# EAGLE design angrlline6 (EAGLE 9.6.2)
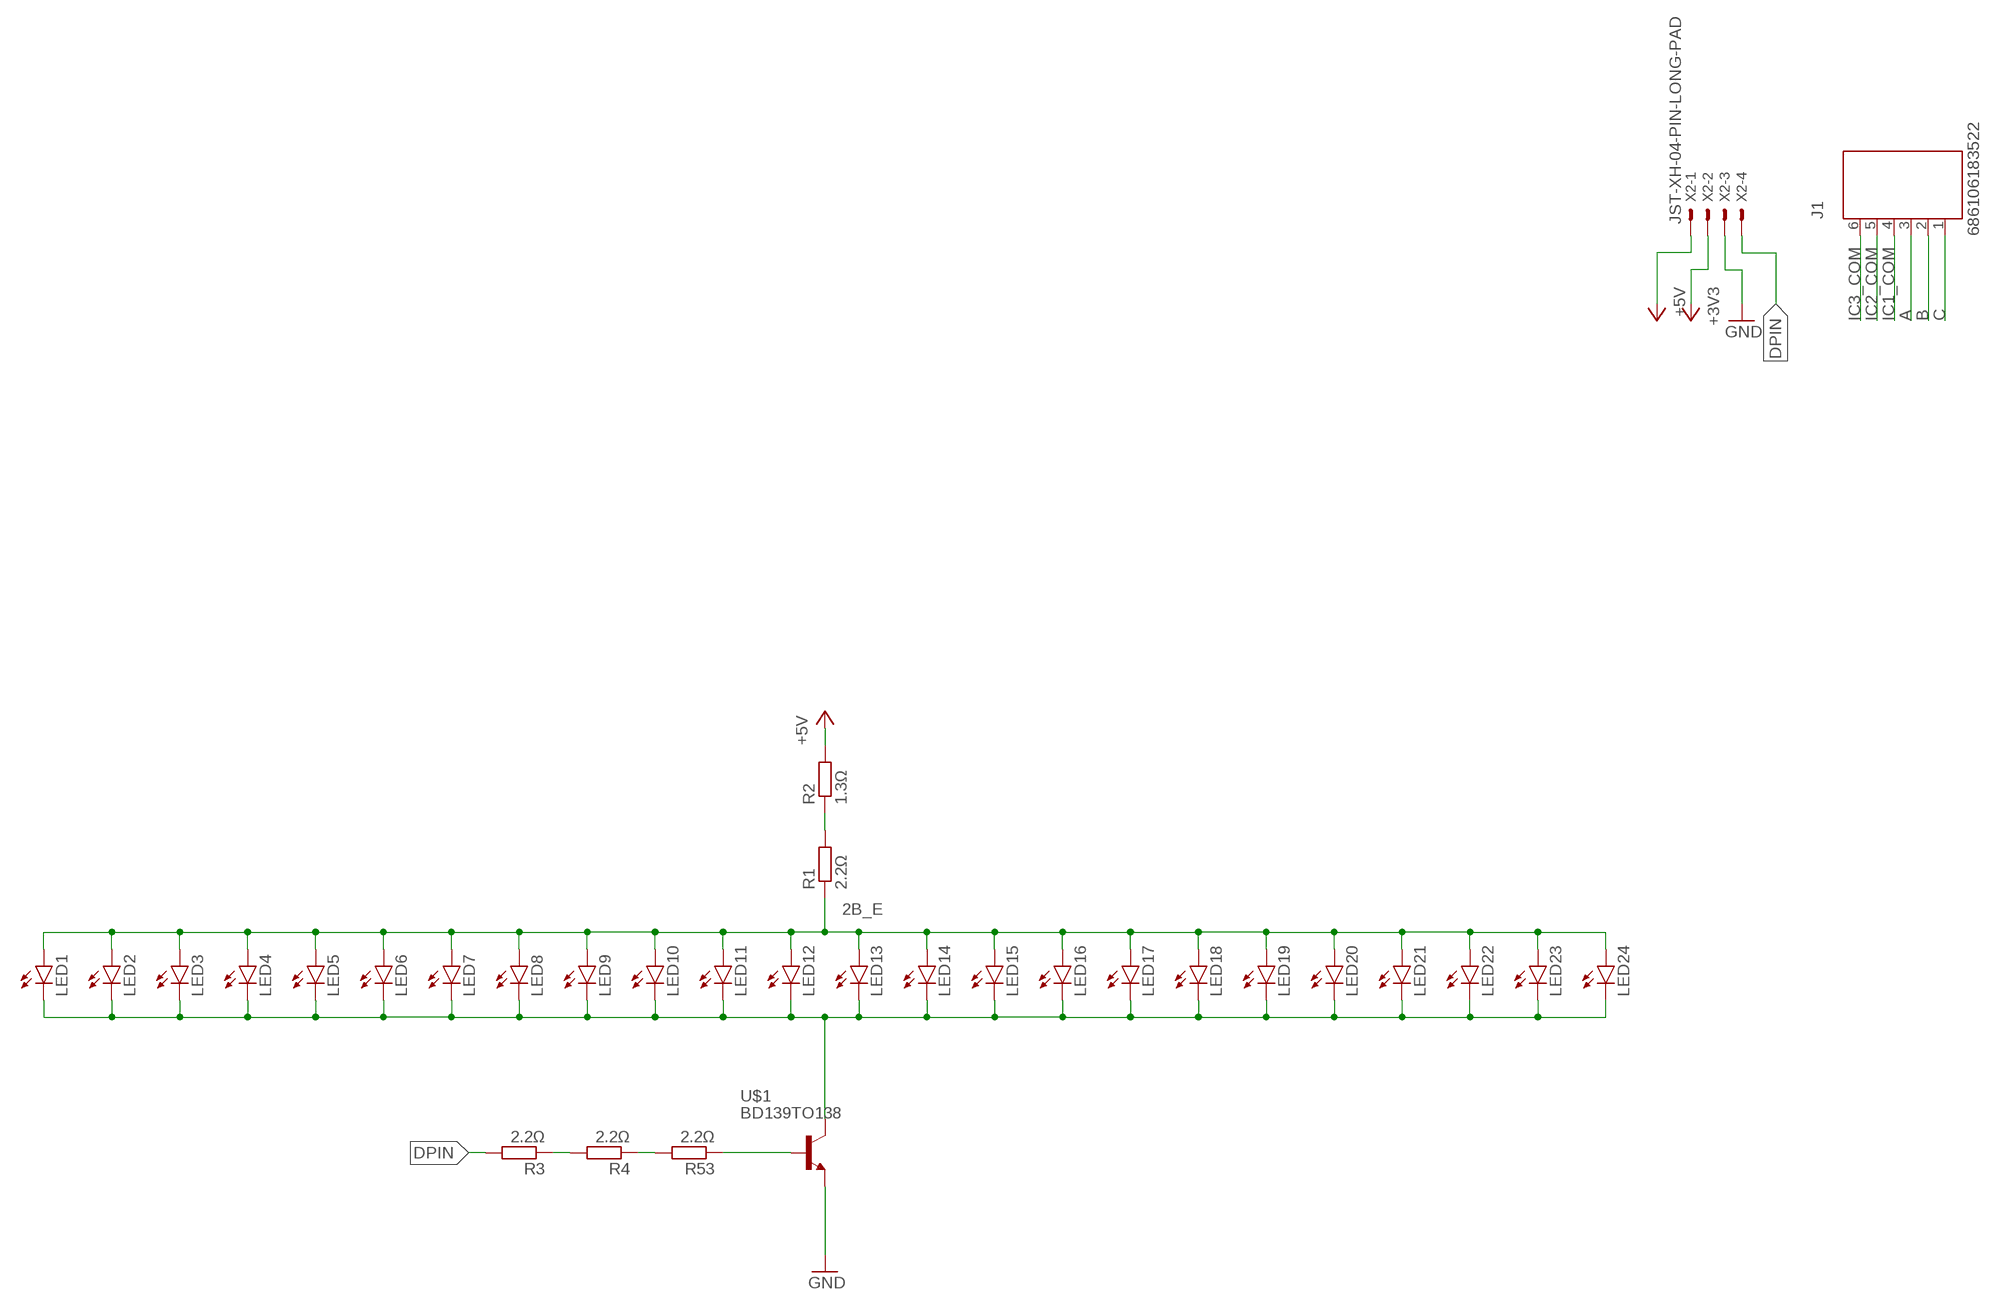
[diagram p0: schematic, sheet 1, part 1 of 2]
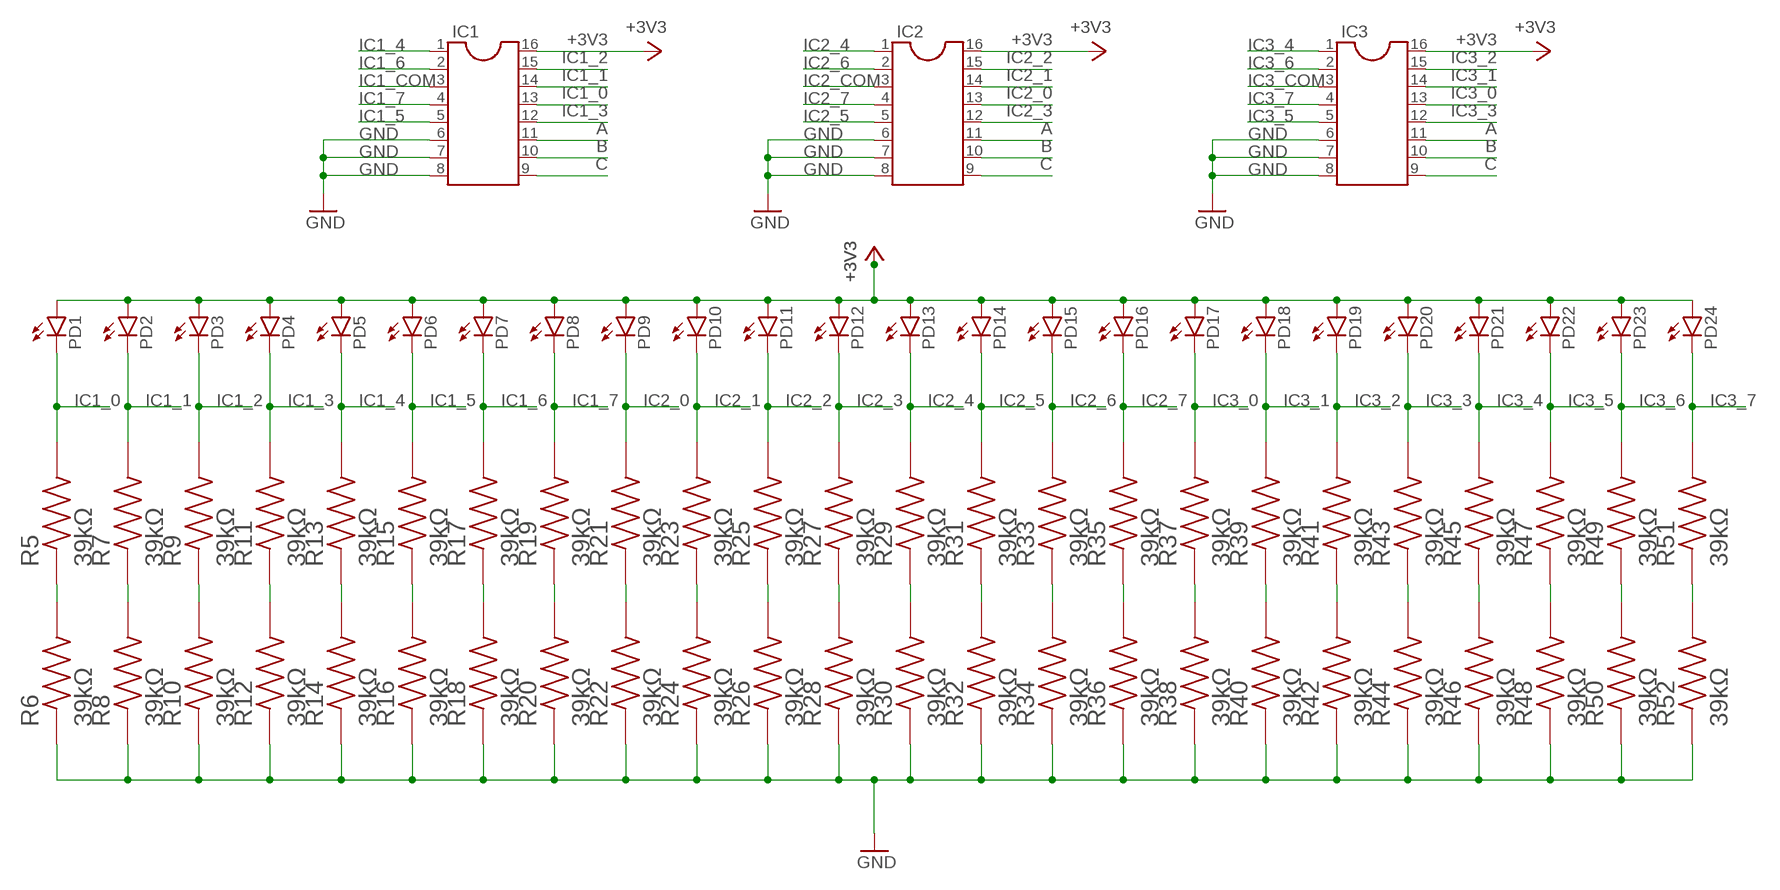
[diagram p1: schematic, sheet 1, part 2 of 2]

## Parts
IC1  DIL16  [DIL16]
IC2  DIL16  [DIL16]
IC3  DIL16  [DIL16]
J1  686106183522  [686106183522]
LED1  LED3MM  [LED3MM]
LED2  LED3MM  [LED3MM]
LED3  LED3MM  [LED3MM]
LED4  LED3MM  [LED3MM]
LED5  LED3MM  [LED3MM]
LED6  LED3MM  [LED3MM]
LED7  LED3MM  [LED3MM]
LED8  LED3MM  [LED3MM]
LED9  LED3MM  [LED3MM]
LED10  LED3MM  [LED3MM]
LED11  LED3MM  [LED3MM]
LED12  LED3MM  [LED3MM]
LED13  LED3MM  [LED3MM]
LED14  LED3MM  [LED3MM]
LED15  LED3MM  [LED3MM]
LED16  LED3MM  [LED3MM]
LED17  LED3MM  [LED3MM]
LED18  LED3MM  [LED3MM]
LED19  LED3MM  [LED3MM]
LED20  LED3MM  [LED3MM]
LED21  LED3MM  [LED3MM]
LED22  LED3MM  [LED3MM]
LED23  LED3MM  [LED3MM]
LED24  LED3MM  [LED3MM]
PD1  LED3MM  [LED3MM]
PD2  LED3MM  [LED3MM]
PD3  LED3MM  [LED3MM]
PD4  LED3MM  [LED3MM]
PD5  LED3MM  [LED3MM]
PD6  LED3MM  [LED3MM]
PD7  LED3MM  [LED3MM]
PD8  LED3MM  [LED3MM]
PD9  LED3MM  [LED3MM]
PD10  LED3MM  [LED3MM]
PD11  LED3MM  [LED3MM]
PD12  LED3MM  [LED3MM]
PD13  LED3MM  [LED3MM]
PD14  LED3MM  [LED3MM]
PD15  LED3MM  [LED3MM]
PD16  LED3MM  [LED3MM]
PD17  LED3MM  [LED3MM]
PD18  LED3MM  [LED3MM]
PD19  LED3MM  [LED3MM]
PD20  LED3MM  [LED3MM]
PD21  LED3MM  [LED3MM]
PD22  LED3MM  [LED3MM]
PD23  LED3MM  [LED3MM]
PD24  LED3MM  [LED3MM]
R1  2.2Ω  R-EU_0207/10  [0207/10]
R2  1.3Ω  R-EU_0207/10  [0207/10]
R3  2.2Ω  R-EU_0207/10  [0207/10]
R4  2.2Ω  R-EU_0207/10  [0207/10]
R5  39kΩ  CRG0603ZR  [RESC1608X55N]
R6  39kΩ  CRG0603ZR  [RESC1608X55N]
R7  39kΩ  CRG0603ZR  [RESC1608X55N]
R8  39kΩ  CRG0603ZR  [RESC1608X55N]
R9  39kΩ  CRG0603ZR  [RESC1608X55N]
R10  39kΩ  CRG0603ZR  [RESC1608X55N]
R11  39kΩ  CRG0603ZR  [RESC1608X55N]
R12  39kΩ  CRG0603ZR  [RESC1608X55N]
R13  39kΩ  CRG0603ZR  [RESC1608X55N]
R14  39kΩ  CRG0603ZR  [RESC1608X55N]
R15  39kΩ  CRG0603ZR  [RESC1608X55N]
R16  39kΩ  CRG0603ZR  [RESC1608X55N]
R17  39kΩ  CRG0603ZR  [RESC1608X55N]
R18  39kΩ  CRG0603ZR  [RESC1608X55N]
R19  39kΩ  CRG0603ZR  [RESC1608X55N]
R20  39kΩ  CRG0603ZR  [RESC1608X55N]
R21  39kΩ  CRG0603ZR  [RESC1608X55N]
R22  39kΩ  CRG0603ZR  [RESC1608X55N]
R23  39kΩ  CRG0603ZR  [RESC1608X55N]
R24  39kΩ  CRG0603ZR  [RESC1608X55N]
R25  39kΩ  CRG0603ZR  [RESC1608X55N]
R26  39kΩ  CRG0603ZR  [RESC1608X55N]
R27  39kΩ  CRG0603ZR  [RESC1608X55N]
R28  39kΩ  CRG0603ZR  [RESC1608X55N]
R29  39kΩ  CRG0603ZR  [RESC1608X55N]
R30  39kΩ  CRG0603ZR  [RESC1608X55N]
R31  39kΩ  CRG0603ZR  [RESC1608X55N]
R32  39kΩ  CRG0603ZR  [RESC1608X55N]
R33  39kΩ  CRG0603ZR  [RESC1608X55N]
R34  39kΩ  CRG0603ZR  [RESC1608X55N]
R35  39kΩ  CRG0603ZR  [RESC1608X55N]
R36  39kΩ  CRG0603ZR  [RESC1608X55N]
R37  39kΩ  CRG0603ZR  [RESC1608X55N]
R38  39kΩ  CRG0603ZR  [RESC1608X55N]
R39  39kΩ  CRG0603ZR  [RESC1608X55N]
R40  39kΩ  CRG0603ZR  [RESC1608X55N]
R41  39kΩ  CRG0603ZR  [RESC1608X55N]
R42  39kΩ  CRG0603ZR  [RESC1608X55N]
R43  39kΩ  CRG0603ZR  [RESC1608X55N]
R44  39kΩ  CRG0603ZR  [RESC1608X55N]
R45  39kΩ  CRG0603ZR  [RESC1608X55N]
R46  39kΩ  CRG0603ZR  [RESC1608X55N]
R47  39kΩ  CRG0603ZR  [RESC1608X55N]
R48  39kΩ  CRG0603ZR  [RESC1608X55N]
R49  39kΩ  CRG0603ZR  [RESC1608X55N]
R50  39kΩ  CRG0603ZR  [RESC1608X55N]
R51  39kΩ  CRG0603ZR  [RESC1608X55N]
R52  39kΩ  CRG0603ZR  [RESC1608X55N]
R53  2.2Ω  R-EU_0207/10  [0207/10]
U$1  BD139TO138  [TO126]
X2  JST-XH-04-PIN-LONG-PAD  [JST-XH-04-PACKAGE-LONG-PAD]

## Nets
2B_E: LED1.A LED2.A LED3.A LED4.A LED5.A LED6.A LED7.A LED8.A LED9.A LED10.A LED11.A LED12.A LED13.A LED14.A LED15.A LED16.A LED17.A LED18.A LED19.A LED20.A LED21.A LED22.A LED23.A LED24.A R1.1
+3V3: IC1.16 IC2.16 IC3.16 PD1.A PD2.A PD3.A PD4.A PD5.A PD6.A PD7.A PD8.A PD9.A PD10.A PD11.A PD12.A PD13.A PD14.A PD15.A PD16.A PD17.A PD18.A PD19.A PD20.A PD21.A PD22.A PD23.A PD24.A X2.2
+5V: R2.2 X2.1
A: IC1.11 IC2.11 IC3.11 J1.3
B: IC1.10 IC2.10 IC3.10 J1.2
BASE: R53.1 U$1.B
C: IC1.9 IC2.9 IC3.9 J1.1
DPIN: R3.2 X2.4
ENCODE: LED1.K(C) LED2.K(C) LED3.K(C) LED4.K(C) LED5.K(C) LED6.K(C) LED7.K(C) LED8.K(C) LED9.K(C) LED10.K(C) LED11.K(C) LED12.K(C) LED13.K(C) LED14.K(C) LED15.K(C) LED16.K(C) LED17.K(C) LED18.K(C) LED19.K(C) LED20.K(C) LED21.K(C) LED22.K(C) LED23.K(C) LED24.K(C) U$1.C
GND: IC1.6 IC1.7 IC1.8 IC2.6 IC2.7 IC2.8 IC3.6 IC3.7 IC3.8 R6.1 R8.1 R10.1 R12.1 R14.1 R16.1 R18.1 R20.1 R22.1 R24.1 R26.1 R28.1 R30.1 R32.1 R34.1 R36.1 R38.1 R40.1 R42.1 R44.1 R46.1 R48.1 R50.1 R52.1 U$1.E X2.3
IC1_0: IC1.13 PD1.K(C) R5.2
IC1_1: IC1.14 PD2.K(C) R7.2
IC1_2: IC1.15 PD3.K(C) R9.2
IC1_3: IC1.12 PD4.K(C) R11.2
IC1_4: IC1.1 PD5.K(C) R13.2
IC1_5: IC1.5 PD6.K(C) R15.2
IC1_6: IC1.2 PD7.K(C) R17.2
IC1_7: IC1.4 PD8.K(C) R19.2
IC1_COM: IC1.3 J1.4
IC2_0: IC2.13 PD9.K(C) R21.2
IC2_1: IC2.14 PD10.K(C) R23.2
IC2_2: IC2.15 PD11.K(C) R25.2
IC2_3: IC2.12 PD12.K(C) R27.2
IC2_4: IC2.1 PD13.K(C) R29.2
IC2_5: IC2.5 PD14.K(C) R31.2
IC2_6: IC2.2 PD15.K(C) R33.2
IC2_7: IC2.4 PD16.K(C) R35.2
IC2_COM: IC2.3 J1.5
IC3_0: IC3.13 PD17.K(C) R37.2
IC3_1: IC3.14 PD18.K(C) R39.2
IC3_2: IC3.15 PD19.K(C) R41.2
IC3_3: IC3.12 PD20.K(C) R43.2
IC3_4: IC3.1 PD21.K(C) R45.2
IC3_5: IC3.5 PD22.K(C) R47.2
IC3_6: IC3.2 PD23.K(C) R49.2
IC3_7: IC3.4 PD24.K(C) R51.2
IC3_COM: IC3.3 J1.6
N$1: R1.2 R2.1
N$4: R7.1 R8.2
N$6: R9.1 R10.2
N$8: R11.1 R12.2
N$10: R13.1 R14.2
N$12: R15.1 R16.2
N$14: R17.1 R18.2
N$16: R19.1 R20.2
N$18: R21.1 R22.2
N$20: R23.1 R24.2
N$22: R25.1 R26.2
N$24: R27.1 R28.2
N$26: R29.1 R30.2
N$27: R5.1 R6.2
N$28: R4.1 R53.2
N$30: R3.1 R4.2
N$31: R31.1 R32.2
N$33: R33.1 R34.2
N$35: R35.1 R36.2
N$37: R37.1 R38.2
N$39: R39.1 R40.2
N$41: R41.1 R42.2
N$43: R43.1 R44.2
N$45: R45.1 R46.2
N$47: R47.1 R48.2
N$49: R49.1 R50.2
N$51: R51.1 R52.2
Unconnected: U$1.C2

## Library data of the parts
IC1-IC3 = ic-package:DIL16: Dual In Line / Socket
J1 = 686106183522:686106183522: 686106183522 WR-FPC 1.00mm SMT Horizontal Bottom Contact - Low Profile <http://katalog.we-online.de/media/images/v2/Family_WR-FPC_6861xx183522.jpg> Details see: http://katalog.we-online.de/en/em/FPC_1_00_SMT_ZIF_HORIZONTAL_BOTTOM_CONTACT_LOW_PROFILE_6861xx183522 Created by Yingchun,shan 2016 (C) Wurth Elektronik Check availability <https://pricing.snapeda.com/parts/686106183522/Wurth%20Electronics/view-part?ref=eda>; AVAILABILITY: In Stock; DESCRIPTION: 6 Position FFC Connector Contacts, Bottom 0.039 (1.00mm) Surface Mount, Right Angle; MF: Wurth Electronics; MP: 686106183522; PACKAGE: None; PRICE: None; PURCHASE-URL: https://pricing.snapeda.com/search/part/686106183522/?ref=eda
LED1-LED24 PD1-PD24 = led:LED: LED OSRAM: - CHIPLED LG R971, LG N971, LY N971, LG Q971, LY Q971, LO R971, LY R971 LH N974, LH R974 LS Q976, LO Q976, LY Q976 LO Q996 - Hyper CHIPLED LW Q18S LB Q993, LB Q99A, LB R99A - SideLED LS A670, LO A670, LY A670, LG A670, LP A670 LB A673, LV A673, LT A673, LW A673 LH A674 LY A675 LS A676, LA A676, LO A676, LY A676, LW A676 LS A679, LY A679, LG A679 - Hyper Micro SIDELED® LS Y876, LA Y876, LO Y876, LY Y876 LT Y87S - SmartLED LW L88C, LW L88S LB L89C, LB L89S, LG L890 LS L89K, LO L89K, LY L89K LS L896, LA L896, LO L896, LY L896 - TOPLED LS T670, LO T670, LY T670, LG T670, LP T670 LSG T670, LSP T670, LSY T670, LOP T670, LYG T670 LG T671, LOG T671, LSG T671 LB T673, LV T673, LT T673, LW T673 LH T674 LS T676, LA T676, LO T676, LY T676, LB T676, LH T676, LSB T676, LW T676 LB T67C, LV T67C, LT T67C, LS T67K, LO T67K, LY T67K, LW E67C LS E67B, LA E67B, LO E67B, LY E67B, LB E67C, LV E67C, LT E67C LW T67C LS T679, LY T679, LG T679 LS T770, LO T770, LY T770, LG T770, LP T770 LB T773, LV T773, LT T773, LW T773 LH T774 LS E675, LA E675, LY E675, LS T675 LS T776, LA T776, LO T776, LY T776, LB T776 LHGB T686 LT T68C, LB T68C - Hyper Mini TOPLED® LB M676 - Mini TOPLED Santana® LG M470 LS M47K, LO M47K, LY M47K Source: http://www.osram.convergy.de LUXEON: - LUMILED® LXK2-PW12-R00, LXK2-PW12-S00, LXK2-PW14-U00, LXK2-PW14-V00 LXK2-PM12-R00, LXK2-PM12-S00, LXK2-PM14-U00 LXK2-PE12-Q00, LXK2-PE12-R00, LXK2-PE12-S00, LXK2-PE14-T00, LXK2-PE14-U00 LXK2-PB12-K00, LXK2-PB12-L00, LXK2-PB12-M00, LXK2-PB14-N00, LXK2-PB14-P00, LXK2-PB14-Q00 LXK2-PR12-L00, LXK2-PR12-M00, LXK2-PR14-Q00, LXK2-PR14-R00 LXK2-PD12-Q00, LXK2-PD12-R00, LXK2-PD12-S00 LXK2-PH12-R00, LXK2-PH12-S00 LXK2-PL12-P00, LXK2-PL12-Q00, LXK2-PL12-R00 Source: www.luxeon.com KINGBRIGHT: KA-3528ASYC Source: www.kingbright.com
R1-R4 R53 = rcl:R-EU_: RESISTOR, European symbol; SPICEPREFIX: R
R5-R52 = CRG0603ZR:CRG0603ZR: CRG0603 ZEROHM Check availability <https://pricing.snapeda.com/parts/CRG0603ZR/TE%20Connectivity/view-part?ref=eda>; AVAILABILITY: In Stock; COMMENT: 1623094-1; DESCRIPTION: CRG0603 ZEROHM; EU_ROHS_COMPLIANCE: Compliant with Exemptions; MF: TE Connectivity; MP: CRG0603ZR; PACKAGE: 0603; PRICE: None; PURCHASE-URL: https://pricing.snapeda.com/search/part/CRG0603ZR/?ref=eda
U$1 = BD139:BD139: Check availability <https://pricing.snapeda.com/parts/BD139/ON/view-part?ref=eda>; AVAILABILITY: In Stock; DESCRIPTION: Bipolar (BJT) Transistor NPN 80 V 1.5 A - 1.25 W Through Hole TO-126-3; MF: ON; MP: BD139; PACKAGE: TO-126 STMicroelectronics; PRICE: None; PURCHASE-URL: https://pricing.snapeda.com/search/part/BD139/?ref=eda
X2 = Rembrandt Electronics - JST XH Connectors v1-0:JST-XH-04-PIN: JST XH Connector 2 Pin Wire to board connector. Pitch: 2,54 mm, (0.100") Number of pins: 4 Created by Rembrandt Electronics www.rembrandtelectronics.com

## Net classes
0 default: width 0.5 mm, clearance 0.3 mm

## Board
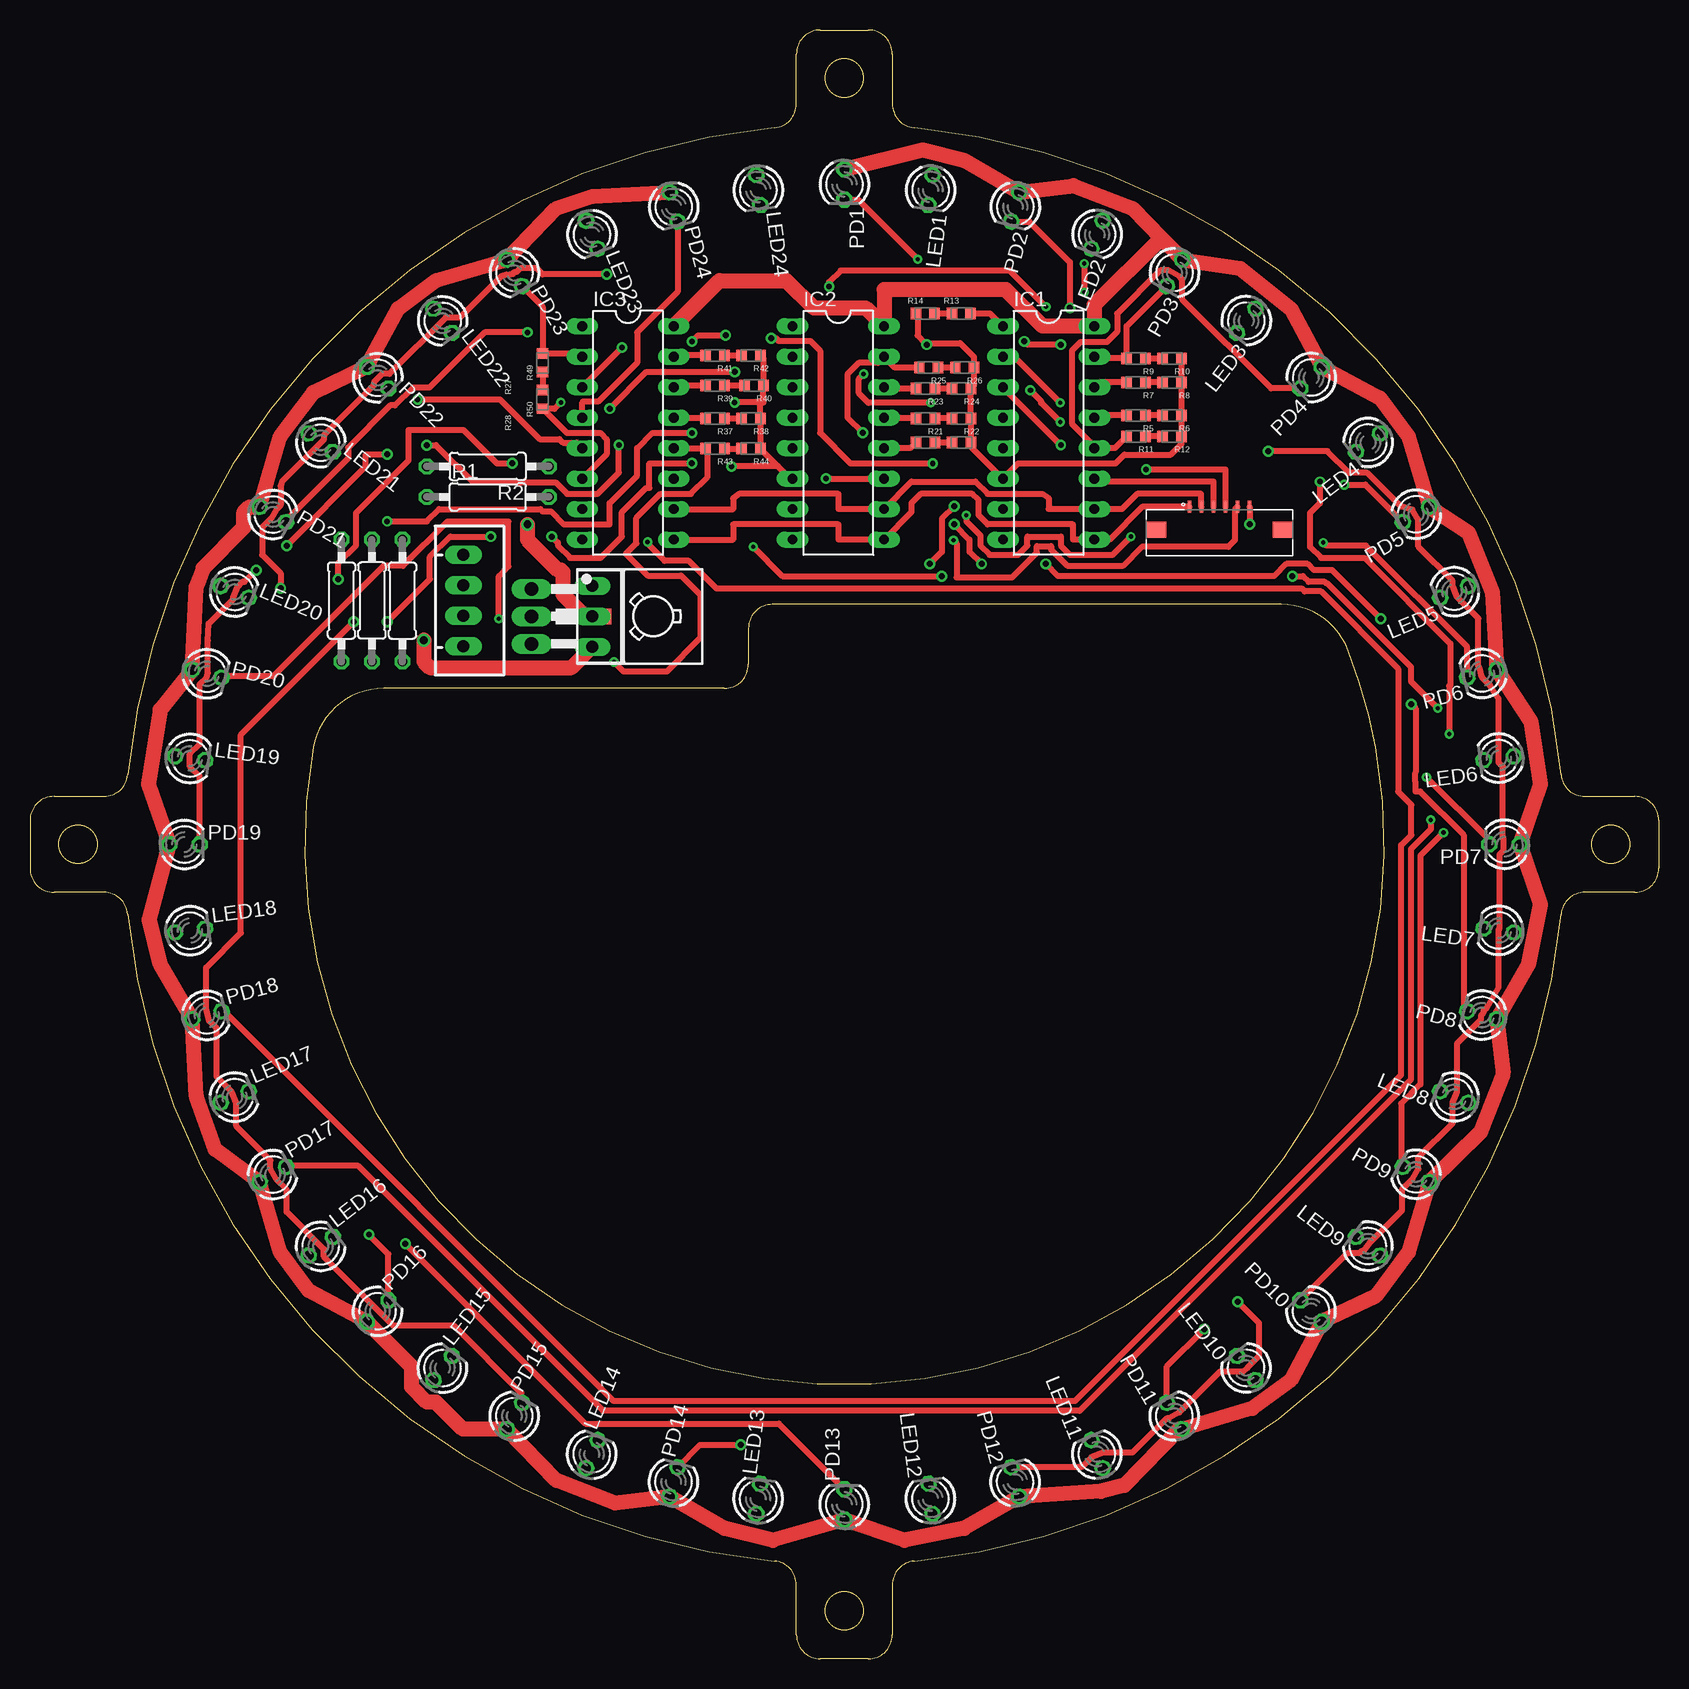
[diagram p2: board, top side]
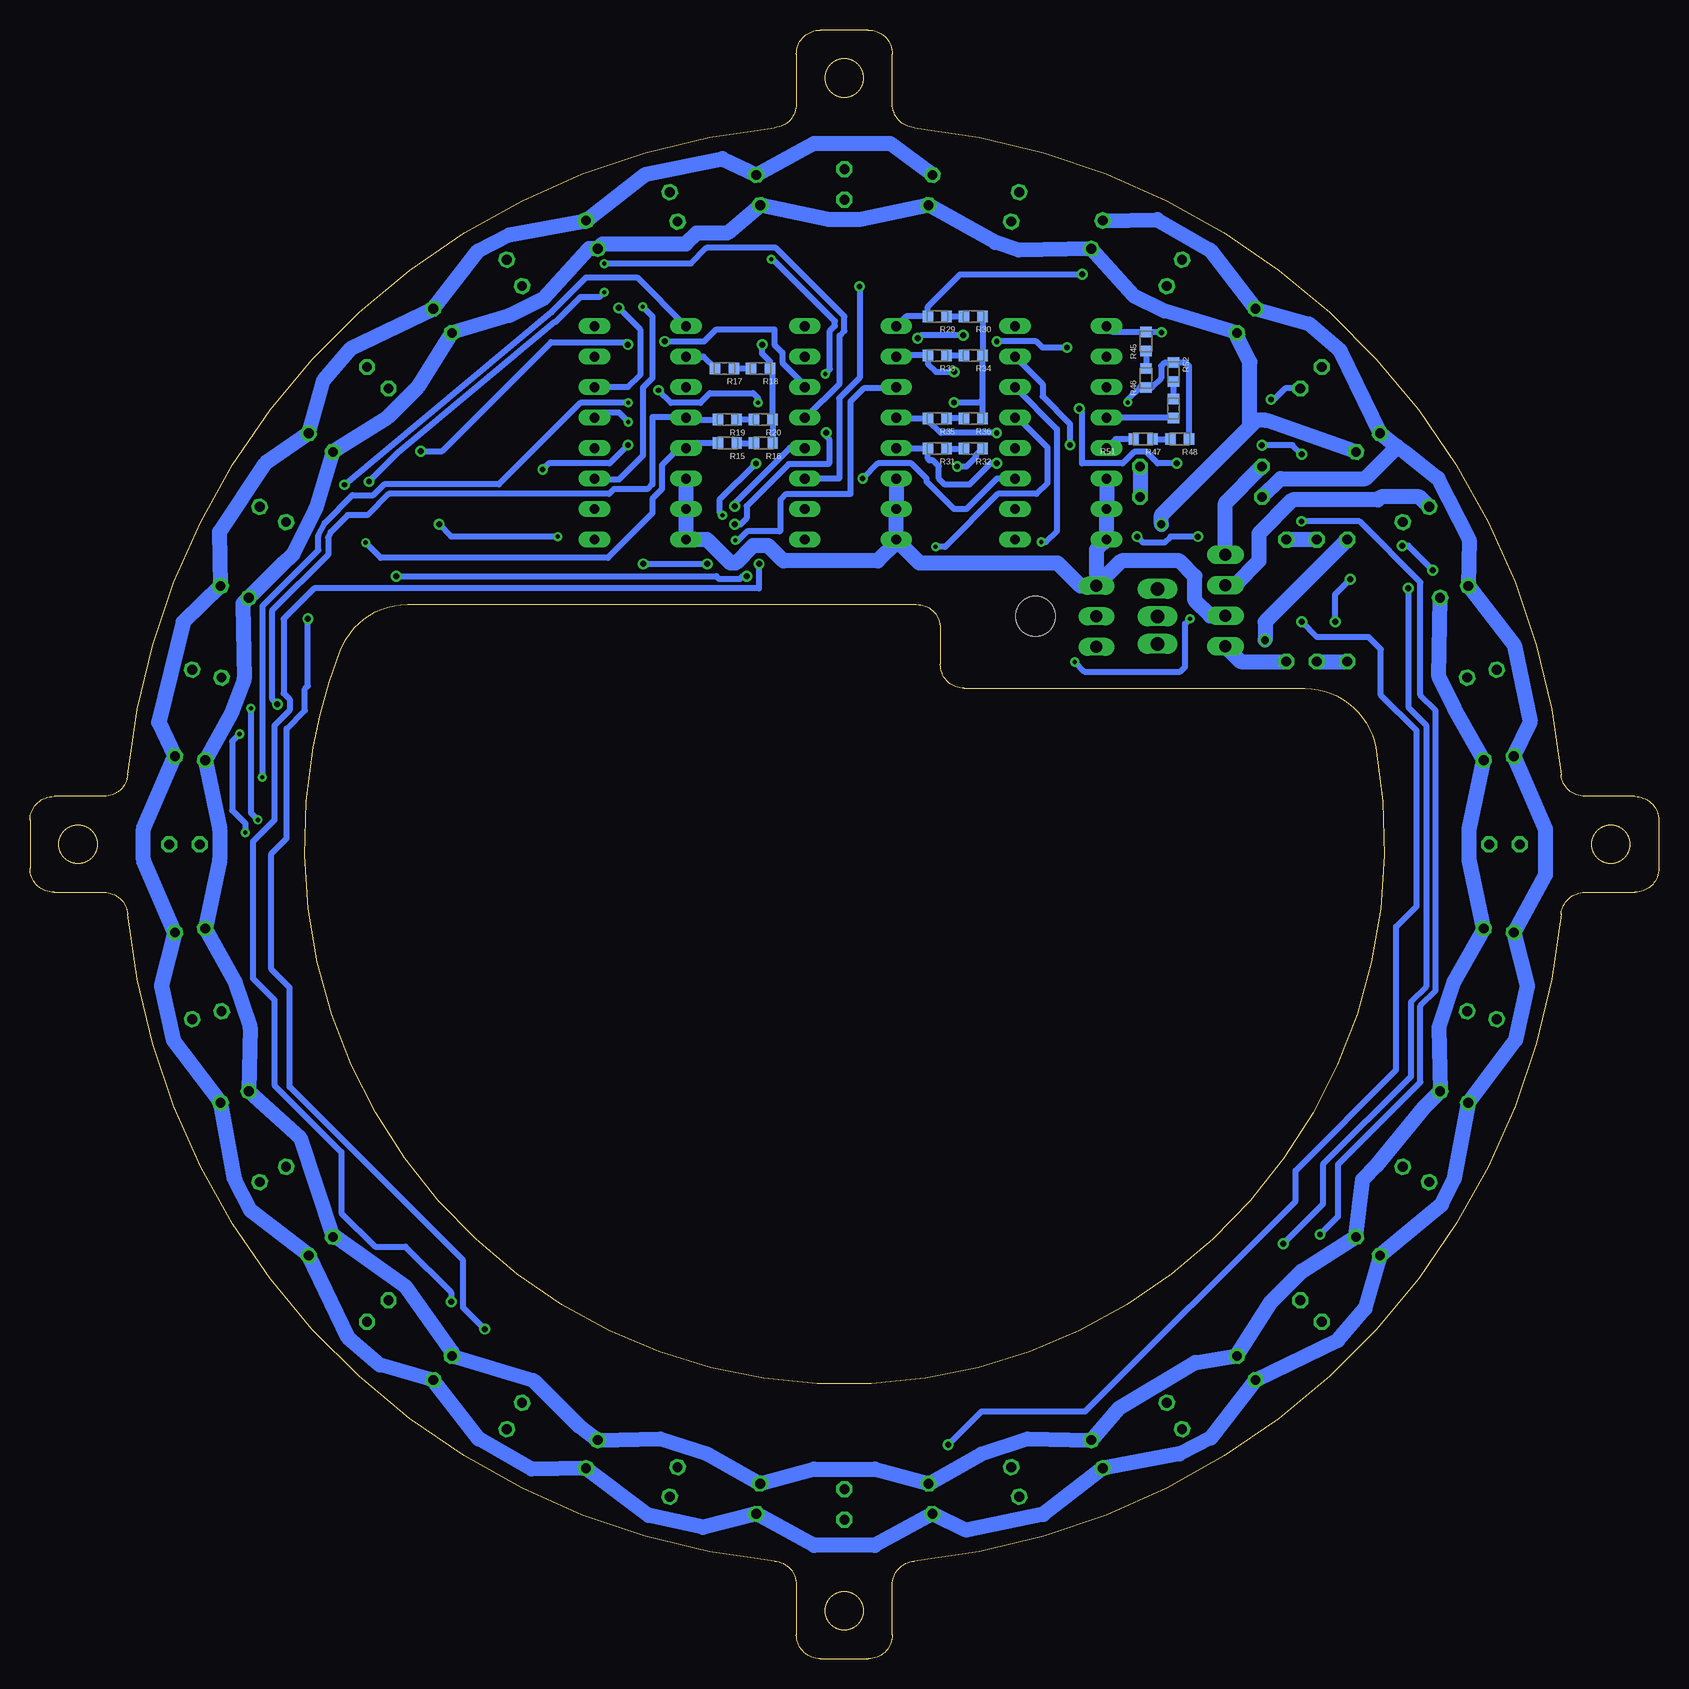
[diagram p3: board, bottom side, seen from below]

Size 135.73 x 135.73 mm. Coordinates in mm from the lower left corner, seen from the top.
Outline: 29.5,80.87 arc80 23.6,75.94
Outline: 23.6,75.94 arc201 112.14,75.94
Outline: 112.14,75.94 arc11 109.87,84.02
Outline: 23.6,75.94 arc201 112.14,75.94
Outline: 109.87,84.02 arc69 104.27,87.87
Outline: 61.87,87.87 arc90 59.87,85.87
Outline: 57.87,80.87 arc90 59.87,82.87
Outline: 57.87,80.87 arc90 59.87,82.87
Outline: 61.87,87.87 arc90 59.87,85.87
Outline: 109.87,84.02 arc69 104.27,87.87
Outline: 23.6,75.94 arc201 112.14,75.94
Outline: 112.14,75.94 arc11 109.87,84.02
Outline: 29.5,80.87 arc80 23.6,75.94
Outline: 57.87,80.87 29.5,80.87
Outline: 104.27,87.87 61.87,87.87
Outline: 59.87,85.87 59.87,82.87
Outline: 63.87,6.16 arc84 62.06,8.15 arc-79 8.15,62.06 arc84 6.16,63.87 2,63.87 arc-90 0,65.87 0,69.87 arc-90 2,71.87 6.16,71.87 arc84 8.15,73.67 arc-79 62.06,127.58 arc84 63.87,129.58 63.87,133.73 arc-90 65.87,135.73 69.87,135.73 arc-90 71.87,133.73 71.87,129.58 arc84 73.67,127.58 arc-79 127.58,73.67 arc84 129.58,71.87 133.73,71.87 arc-90 135.73,69.87 135.73,65.87 arc-90 133.73,63.87 129.58,63.87 arc84 127.58,62.06 arc-79 73.67,8.15 arc84 71.87,6.16 71.87,2 arc-90 69.87,0 65.87,0 arc-90 63.87,2 63.87,6.16
Outline: circle at 67.87,131.73 radius 1.6
Outline: circle at 4,67.87 radius 1.6
Outline: circle at 67.87,4 radius 1.6
Outline: circle at 131.73,67.87 radius 1.6
Outline: circle at 4,67.87 radius 1.6
Outline: circle at 131.73,67.87 radius 1.6
Outline: circle at 67.87,4 radius 1.6
Outline: circle at 67.87,4 radius 1.6
Outline: circle at 131.73,67.87 radius 1.6
Outline: circle at 4,67.87 radius 1.6
Outline: circle at 67.87,131.73 radius 1.6
Outline: circle at 67.87,131.73 radius 1.6
Outline: circle at 67.87,131.73 radius 1.6
Outline: circle at 4,67.87 radius 1.6
Outline: circle at 67.87,4 radius 1.6
Outline: circle at 131.73,67.87 radius 1.6
Outline: circle at 67.87,131.73 radius 1.6
Outline: circle at 131.73,67.87 radius 1.6
Outline: circle at 67.87,4 radius 1.6
Outline: circle at 4,67.87 radius 1.6
Copper layers (1*16): Top 0.035mm / dielectric 1.5mm / Bottom 0.035mm
Design rules "default": minimum track width 6mil, minimum drill 0.35mm, track to track 6mil, track to pad 6mil, pad to pad 6mil, via to via 6mil, smd to smd 6mil, copper to edge 40mil, drill to drill 6mil, minimum pad ring 10mil, minimum via ring 8mil, stop-mask expansion 4mil, vias tented up to drill 0mil, thermal gap 10mil

### Footprints (pad centres in the part's own frame; a part is rotated, then mirrored left to right if it is on the bottom)
DIL16 = drill 0.813 long: 1 -8.89,-3.81; 2 -6.35,-3.81; 3 -3.81,-3.81; 4 -1.27,-3.81; 5 1.27,-3.81; 6 3.81,-3.81; 7 6.35,-3.81; 8 8.89,-3.81; 9 8.89,3.81; 10 6.35,3.81; 11 3.81,3.81; 12 1.27,3.81; 13 -1.27,3.81; 14 -3.81,3.81; 15 -6.35,3.81; 16 -8.89,3.81
686106183522 = smd 0.3 x 1: 1 -2.5,1.9; 2 -1.5,1.9; 3 -0.5,1.9; 4 0.5,1.9; 5 1.5,1.9; 6 2.5,1.9 | smd 1.65 x 1.3: Z1 -5.275,0; Z2 5.275,0
LED3MM = drill 0.813 octagon: A -1.27,0; K 1.27,0
0207/10 = drill 0.813 octagon: 1 -5.08,0; 2 5.08,0
RESC1608X55N = smd 0.87 x 0.97: 1 -0.78,0; 2 0.78,0
TO126 = drill 1.118 long: 1 -2.286,-5.08; 2 0,-5.08; 3 2.286,-5.08 | drill 1 long: B 2.54,0; C 0,0; E -2.54,0 | smd 1.27 x 0.635: C2 0,1.27 | hole 3.302: 0,5.08
JST-XH-04-PACKAGE-LONG-PAD = drill 1.016 long: 1 -3.81,0; 2 -1.27,0; 3 1.27,0; 4 3.81,0

### Placement (x,y rotation side)
IC1  84.88,102.16 270 top
IC2  67.36,102.16 270 top
IC3  49.83,102.16 270 top
J1  99.12,94.09 0 top
LED1  75.05,122.4 262.5 top
LED2  88.91,118.68 247.5 top
LED3  101.35,111.5 232.5 top
LED4  111.5,101.35 217.5 top
LED5  118.68,88.91 202.5 top
LED6  122.4,75.05 187.5 top
LED7  122.4,60.69 172.5 top
LED8  118.68,46.82 157.5 top
LED9  111.5,34.38 142.5 top
LED10  101.35,24.23 127.5 top
LED11  88.91,17.05 112.5 top
LED12  75.05,13.34 97.5 top
LED13  60.69,13.34 82.5 top
LED14  46.82,17.05 67.5 top
LED15  34.38,24.23 52.5 top
LED16  24.23,34.38 37.5 top
LED17  17.05,46.82 22.5 top
LED18  13.34,60.69 7.5 top
LED19  13.34,75.05 352.5 top
LED20  17.05,88.91 337.5 top
LED21  24.23,101.35 322.5 top
LED22  34.38,111.5 307.5 top
LED23  46.82,118.68 292.5 top
LED24  60.69,122.4 277.5 top
PD1  67.87,122.87 270 top
PD2  82.1,120.99 255 top
PD3  95.37,115.5 240 top
PD4  106.76,106.76 225 top
PD5  115.5,95.37 210 top
PD6  120.99,82.1 195 top
PD7  122.87,67.87 180 top
PD8  120.99,53.63 165 top
PD9  115.5,40.37 150 top
PD10  106.76,28.98 135 top
PD11  95.37,20.24 120 top
PD12  82.1,14.74 105 top
PD13  67.87,12.87 90 top
PD14  53.63,14.74 75 top
PD15  40.37,20.24 60 top
PD16  28.98,28.98 45 top
PD17  20.24,40.37 30 top
PD18  14.74,53.63 15 top
PD19  12.87,67.87 0 top
PD20  14.74,82.1 345 top
PD21  20.24,95.37 330 top
PD22  28.98,106.76 315 top
PD23  40.37,115.5 300 top
PD24  53.63,120.99 285 top
R1  38.15,96.82 0 top
R2  38.15,99.36 180 top
R3  31.04,88.19 270 top
R4  28.5,88.19 90 top
R5  92.17,103.61 180 top
R6  95.17,103.61 180 top
R7  92.17,106.36 180 top
R8  95.17,106.36 180 top
R9  92.17,108.36 180 top
R10  95.17,108.36 180 top
R11  92.17,101.87 180 top
R12  95.17,101.87 180 top
R13  77.61,112.11 0 top
R14  74.61,112.11 0 top
R15  77.62,101.3 180 bottom
R16  74.62,101.3 180 bottom
R17  77.86,107.53 180 bottom
R18  74.86,107.53 180 bottom
R19  77.62,103.26 180 bottom
R20  74.62,103.26 180 bottom
R21  74.63,103.36 180 top
R22  77.63,103.36 180 top
R23  74.63,105.85 180 top
R24  77.63,105.85 180 top
R25  74.88,107.6 180 top
R26  77.88,107.6 180 top
R27  74.63,101.36 180 top
R28  77.63,101.36 180 top
R29  60.12,111.87 180 bottom
R30  57.12,111.87 180 bottom
R31  60.12,100.85 180 bottom
R32  57.12,100.85 180 bottom
R33  60.12,108.61 180 bottom
R34  57.12,108.61 180 bottom
R35  60.12,103.36 180 bottom
R36  57.12,103.36 180 bottom
R37  57.08,103.36 180 top
R38  60.08,103.36 180 top
R39  57.08,106.1 180 top
R40  60.34,106.1 180 top
R41  57.08,108.61 180 top
R42  60.08,108.61 180 top
R43  57.08,100.85 180 top
R44  60.08,100.85 180 top
R45  42.72,109.78 90 bottom
R46  42.72,106.73 90 bottom
R47  42.97,101.65 180 bottom
R48  39.93,101.65 180 bottom
R49  42.72,108 90 top
R50  42.72,104.95 90 top
R51  40.43,104.19 270 bottom
R52  40.43,107.24 270 bottom
R53  25.96,88.19 270 top
U$1  46.87,86.87 270 top
X2  36.12,88.19 270 top

### Tracks (layer width: path | path; a pad name or v marks a point on that pad's centre or on a via)
2B_E
  Bottom 1.27: LED23.A 41.8,119.93 37.39,117.4 LED22.A 29.15,111.23 26.53,109 LED21.A 21.79,101.02 | 21.79,101.02 21.11,100.49 18.4,98.4 15.8,93.27 LED20.A 12.04,84.44 10.72,78.03 LED19.A 9.45,69.14 9.45,65.33 LED18.A 10.95,56.09 11.95,51.54 LED17.A 17.07,39.93 18.11,37.83 LED16.A 24.5,29.15 26.73,26.53 LED15.A 37.34,18.4 39.93,17.07 LED14.A 51.29,12.04 57.71,10.72 LED13.A 65.33,9.45 70.41,9.45 LED12.A 79.64,10.95 84.2,11.95 LED11.A 93.94,15.81 98.35,18.34 LED10.A 106.58,24.5 109.2,26.73 LED9.A 117.33,37.34 118.67,39.93 LED8.A 123.79,51.54 124.78,56.09 LED7.A 126.29,66.6 126.29,69.14 LED6.A 125.02,78.03 122.97,86.39 LED5.A 119.93,93.94 116.13,99.62 LED4.A 111.23,106.58 109,109.2 LED3.A 98.4,117.33 95.81,118.67 LED2.A 84.44,123.69 78.03,125.02 LED1.A 70.41,126.29 64.06,126.29 LED24.A | R1.1 31.54,98.35 24.46,98.35 21.79,101.02
+3V3
  Top 1.27: PD1.A 74.4,125.75 77.87,124.87 PD2.A 86.96,122.76 91.87,120.87 94.26,118.4 | 94.26,118.4 94.89,117.74 PD3.A 100.87,115.87 105.08,112.49 PD4.A 112.52,105.05 114.87,101.87 PD5.A 119.87,93.87 121.87,88.87 PD6.A 125.07,78.08 125.87,72.87 PD7.A 125.87,62.87 124.87,57.87 PD8.A 122.76,48.77 120.87,43.87 PD9.A 114.87,33.87 112.13,30.22 PD10.A 105.05,23.21 101.87,20.87 PD11.A 95.75,19.14 91.21,14.45 89.24,13.96 PD12.A 77.87,10.87 72.87,9.87 PD13.A 61.9,9.88 57.87,10.87 PD14.A 48.77,12.97 43.87,14.87 PD15.A 36.08,19.14 33.83,21.38 33.07,21.38 31.8,22.65 31.8,24.36 PD16.A 23.21,30.68 20.87,33.87 PD17.A 15.42,42.46 13.87,46.87 PD18.A 10.87,57.87 9.93,61.63 PD19.A 9.87,72.87 10.85,79.1 PD20.A 13.84,89.3 14.13,90.02 14.43,90.77 14.43,90.88 17.83,94.28 17.83,95.55 18.28,96 PD21.A 20.87,101.87 23.6,105.51 PD22.A 30.68,112.52 33.87,114.87 PD23.A 43.87,120.87 46.87,121.87 PD24.A | 94.26,118.4 88.69,112.82 88.69,111.06 IC1.16 84.38,111.05 81.33,114.09 71.17,114.09 IC2.16 69.64,112.57 65.33,112.57 63.04,114.86 57.45,114.86 IC3.16
  Bottom 1.27: PD21.A 19.96,96.82 23.16,96.82 23.42,96.57 30.53,96.57 33.32,93.77 33.32,91.49 35.35,89.46 X2.2
+5V
  Bottom 1.27: X2.1 36.12,96.31 R2.2
A  (via drill 0.35, 0.45)
  Top 0.5: IC1.11 88.95,98.09 98.62,98.09 J1.3 | v84.67,112.67 81.65,115.68 67.55,115.68 66.6,114.73 v66.6,114.35 | v66.34,98.35 IC2.11
  Bottom 0.5: IC2.11 68.3,98.35 68.3,105.03 66.6,106.74 v66.6,114.35 | IC1.11 88.67,98.27 86.67,98.27 84.67,100.27 84.67,105.93 83.87,106.73 83.87,111.87 v84.67,112.67 | v66.34,98.35 65.07,99.62 62.28,99.62 61.01,98.35 61.01,98.09 58.72,95.81 57.71,95.81 55.17,98.35 IC3.11
B
  Top 0.5: J1.2 97.58,96.02 97.58,97.08 92.25,97.08 90.98,95.81 IC1.10 84.88,95.81 84.88,96.73 84.39,97.08 79.8,97.08 78.79,98.09 73.45,98.09 IC2.10 67.36,95.81 67.36,97.08 59.09,97.08 58.6,96.69 58.6,95.81 IC3.10
BASE  (via drill 0.65)
  Top 1.27: v32.81,84.88 32.81,83.11 33.32,82.6 45.14,82.6 U$1.B
  Bottom 1.27: v32.81,84.88 32.81,86.41 R53.1
C
  Top 0.5: J1.1 92.69,95.99 89.96,93.27 IC1.9 86.92,93.27 86.92,94.54 79.8,94.54 79.04,95.3 79.04,96.57 78.53,97.08 74.22,97.08 73.45,96.31 73.45,95.55 IC2.9 67.36,93.27 67.36,94.54 58.6,94.54 58.6,93.27 IC3.9
DPIN
  Bottom 1.27: X2.4 34.85,83.11 R3.2
ENCODE  (via drill 0.65)
  Top 1.27: U$1.C 46.23,86.87 44.4,88.69 44.4,90.57 44.24,90.73 43.99,90.73 41.45,93.27 v41.45,94.54
  Bottom 1.27: LED21.K 32.73,103.19 33.56,103.19 34.08,102.66 | LED20.K 18.34,81.84 17.07,79.3 LED19.K 15.8,69.14 15.8,66.6 LED18.K 17.07,56.44 18.34,52.63 LED17.K 19.56,45.97 23.48,41.13 24.69,39.93 LED16.K 29.77,32.31 32.31,29.77 LED15.K 38.66,24.69 45.01,20.88 LED14.K 52.63,18.34 56.44,17.07 LED13.K 65.33,15.8 70.41,15.8 LED12.K 79.3,17.07 83.2,18.33 LED11.K 90.02,19.41 93.81,23.2 LED10.K 100.58,25.6 104.44,31.04 110.24,35.16 LED9.K 110.49,35.22 113.22,43.4 LED8.K 117.4,52.63 118.67,56.44 LED7.K 119.94,66.6 119.94,69.14 LED6.K 118.94,78.8 117.9,81.64 118,87.93 LED5.K 114.68,91.26 113.82,92.04 111.93,95.82 LED4.K 105.97,103.43 103.43,105.97 LED3.K 95.82,111.93 92.93,113.37 89.17,117.51 LED2.K 88.03,117.9 81.07,117.9 80.17,118.81 77.63,118.81 LED1.K 69.14,119.94 66.6,119.94 LED24.K 55.31,118.04 53.34,117.38 LED23.K 43.74,113.59 41.2,112.32 LED22.K 35.16,110.24 34.08,108.06 34.08,102.66 | v41.45,94.54 41.45,95.3 34.08,102.66
GND  (via drill 0.35, 0.45, 0.5)
  Top 0.5: 60.86,104.7 R38.1 R44.1 62.32,99.4 | R42.1 61.12,108.36 R40.1 61.12,104.7 60.86,104.7 | IC2.6 63.37,98.35 62.32,99.4 | R10.1 R8.1 R6.1 R12.1 95.95,101.22 95.07,100.34 91.2,100.34 90.47,99.62 82.34,99.62 IC1.6 78.41,101.01 R28.1 R22.1 R24.1 78.66,106.1 R26.1 78.66,108.5 77.51,109.65 74.6,109.65 | IC3.6 48.05,100.38 48.05,101.65 47.55,102.16 44.73,102.16 R50.1 43.72,104.17 v44.24,104.7 | R14.1 73.96,111.97 73.96,110.28 74.6,109.65 | 62.32,99.4 58.51,99.4 v58.47,99.36 | 60.86,104.7 v58.72,104.7 | v74.72,109.52 74.6,109.65
  Bottom 0.5: R30.1 R34.1 56.34,104.95 | R36.1 56.34,104.95 | R16.1 R20.1 73.84,107.3 R18.1 74.08,108.12 74.72,108.76 v74.72,109.52 | R48.1 39.15,107.73 39.44,108.02 R52.1 40.45,108 41.2,108 41.47,107.73 41.47,106.73 42.25,105.95 R46.1 42.74,105.97 43.23,105.97 44.24,104.95 v44.24,104.7 | R32.1 56.92,100.28 56.92,100.14 57.69,99.36 v58.47,99.36 | v58.72,104.7 56.59,104.7 56.34,104.95
  Bottom 1.27: U$1.E 48.2,89.41 50.11,91.31 61.59,91.31 IC2.8 | X2.3 37.39,86.92 38.66,88.19 38.66,90.22 39.93,91.49 44.78,91.49 U$1.E | U$1.E 46.87,92.42 IC3.8 IC3.7 IC3.6 | IC2.8 IC2.7 IC2.6 | IC1.6 IC1.7 IC1.8 79.3,93.27 77.34,91.31 76.93,91.31 75.49,92.76 74.22,92.76 72.95,91.49 65.07,91.49 63.55,93.01 IC2.8
IC1_0  (via drill 0.35, 0.45)
  Top 0.5: R5.2 88.88,103.61 IC1.13 | v73.97,116.63 69.01,121.6 PD1.K | v69.47,107.07 69.07,106.67 69.07,105.47 69.87,104.67 v75.07,104.67 | v85.87,103.07 84.27,104.67 84.27,104.81 v83.36,105.71
  Bottom 0.5: v73.97,116.63 73.83,116.63 68.67,111.47 68.67,111.07 69.07,110.67 69.07,107.47 v69.47,107.07 | v75.07,104.67 75.07,105.07 75.47,105.47 79.07,105.47 79.87,104.67 82.31,104.67 v83.36,105.71 | v85.87,103.07 86.67,103.87 88.27,103.87 88.67,103.47 IC1.13
IC1_1  (via drill 0.5)
  Top 0.5: R7.2 89.09,106.36 IC1.14 | PD2.K 83.28,119.77 86.66,116.38 v86.66,112.57
  Bottom 0.5: v86.66,112.57 84.88,110.79 84.88,106.98 85.9,105.97 IC1.14
IC1_2
  Top 0.5: IC1.15 88.84,108.36 R9.2 91.39,111.06 PD3.K
IC1_3
  Top 0.5: R11.2 90.41,100.89 IC1.12 88.69,101.05 86.82,102.93 86.82,109.01 87.53,109.72 89.74,109.72 90.59,110.57 90.59,112.1 94.19,115.7 94.9,115.7 95.77,115.2 96.03,114.94 96.03,113.25 103.42,105.86 PD4.K
IC1_4  (via drill 0.45)
  Top 0.5: IC1.1 80.01,112.11 R13.2 | v109.52,97.84 111.29,97.84 PD5.K
  Bottom 0.5: IC1.1 85.14,115.11 89.38,115.11 92.29,112.2 v109.52,97.84
IC1_5  (via drill 0.35)
  Top 0.5: PD6.K 119.77,84.32 111.33,92.76 108.02,92.76 v107.77,93.02
  Bottom 0.5: R15.2 80.66,101.3 IC1.5 81.47,101.07 83.07,99.47 83.07,97.47 83.87,96.67 83.87,95.47 87.58,91.75 106.51,91.75 v107.77,93.02
IC1_6  (via drill 0.35)
  Top 0.5: PD7.K 121.6,68.24 v116.37,73.47 | v85.87,104.67 82.27,108.27 81.47,108.27 IC1.2
  Bottom 0.5: IC1.2 79.61,108.51 R17.2 | v116.37,73.47 116.37,87.72 111.7,92.4 111.7,93.63 111.19,94.65 108.87,96.97 107.13,96.97 106.23,97.87 96.67,97.87 89.87,104.67 v85.87,104.67
IC1_7  (via drill 0.5)
  Top 0.5: PD8.K 119.47,54.27 119.47,68.67 115.87,72.27 115.47,72.27 115.47,73.06 115.45,73.08 115.45,73.85 115.47,73.87 115.47,79.19 v115.11,79.55
  Bottom 0.5: R19.2 80.91,103.26 IC1.4 81.47,103.47 83.87,103.47 83.87,97.87 84.27,97.47 87.07,97.47 87.47,97.07 105.83,97.07 107.6,95.3 109.27,95.3 110.67,93.9 110.9,93.44 110.9,92 115.57,87.32 115.57,80.01 v115.11,79.55
IC1_COM  (via drill 0.45)
  Top 0.5: IC1.3 v85.9,101.14 | v93.01,99.11 99.62,99.11 99.62,99.1 J1.4
  Bottom 0.5: v85.9,101.14 87.42,99.62 92.5,99.62 v93.01,99.11
IC2_0  (via drill 0.35, 0.45)
  Top 0.5: R21.2 71.24,103.36 IC2.13 | v117.79,68.85 115.87,66.93 115.87,47.87 114.27,46.27 114.27,41.07 PD9.K | v118.27,77.07 118.27,81.07 118.37,81.17 118.37,84.59 111.22,91.74 107.59,91.74 106.67,92.67 106.67,95.47 107.49,96.29 v107.49,98.09 | v87.87,116.27 v87.87,113.87
  Bottom 0.5: v117.79,68.85 117.79,69.61 118.88,70.7 118.88,76.45 v118.27,77.07 | v87.87,113.87 88.27,113.47 89.86,113.47 91.92,111.4 92,111.4 105.1,100.49 v107.49,98.09 | v87.87,116.27 80.67,116.27 79.36,117.57 73.57,117.57 67.87,111.87 67.87,110.67 68.27,110.27 68.27,106.27 71.07,103.47 IC2.13
IC2_1  (via drill 0.5)
  Top 0.5: R23.2 71.28,105.85 IC2.14 | PD10.K 109.82,33.83 110.79,33.83 110.96,34 111.15,34.02 111.69,34.72 114.35,37.39 114.35,39.12 115.2,39.96 115.7,40.83 115.7,41.78 118.54,44.63 118.54,46.33 118.92,47.24 118.92,51.28 120.93,53.28 120.93,53.62 121.07,53.76 121.1,53.79 121.18,54.1 121.38,54.22 122.39,55.96 122.39,60.76 122.48,60.85 122.48,67.03 122.81,67.37 122.81,68.37 122.73,68.44 122.73,74.35 122.39,74.69 122.39,80.01 121.65,81.14 121.02,81.77 121,81.85 | 121,81.85 | 121,81.85 120.81,82.57 120.7,82.68 120.7,86.7 118.93,88.47 118.54,89.4 118.54,89.83 115.7,92.68 115.7,94.9 115.2,95.77 114.23,96.03 111.44,98.82 109.93,98.82 108.11,100.63 v103.17,100.63 | v85.9,109.52 83.11,109.52 v82.85,109.78
  Bottom 0.5: v103.17,100.63 101.39,100.63 92.31,109.72 86.09,109.72 v85.9,109.52 | v82.85,109.78 79.55,109.78 78.53,110.79 73.71,110.79 73.71,109.52 73.04,108.85 73.04,108.01 71.17,106.13 IC2.14
IC2_2  (via drill 0.5)
  Top 0.5: R25.2 72.08,107.6 IC2.15 70.66,107.99 69.08,107.99 68.12,107.03 68.12,103.43 v69.39,102.16 | PD11.K 94.73,24.37 v97.84,27.48 | v112.57,86.66 108.51,90.73 106.98,90.73 106.47,91.23 104.7,91.23 103.68,90.22 85.65,90.22 v84.63,91.23 | v77.01,94.54 78.28,93.27 78.28,92.25 v79.3,91.23
  Bottom 0.5: v97.84,27.48 99.63,29.27 99.63,33.2 114.09,47.66 114.09,55.93 115.62,57.45 115.62,67.1 114.35,68.37 114.35,77.52 112.82,79.04 112.82,80.82 112.57,81.07 v112.57,86.66 | v69.39,102.16 69.39,101.9 69.14,101.65 69.14,99.62 69.2,99.56 72.51,99.56 76.01,96.06 76.01,95.04 76.52,94.54 v77.01,94.54 | v84.63,91.23 v79.3,91.23
IC2_3  (via drill 0.5)
  Top 0.5: R27.2 73.38,100.89 IC2.12 | v74.98,91.23 75.99,92.25 75.99,95.04 v77.01,96.06 | v100.63,29.77 102.41,27.99 102.41,25.19 101.46,24.24 101.05,23.92 99.16,23.92 95.77,20.54 94.9,20.04 94.71,20.04 91.87,17.19 89.4,17.19 88.47,16.81 87.63,15.97 PD12.K
  Bottom 0.5: v77.01,96.06 77.01,96.31 72.44,100.89 IC2.12 | v74.98,91.23 74.98,89.2 112.06,89.2 114.6,86.66 114.6,80.46 114.11,79.97 114.11,79.06 114.09,79.04 115.36,77.77 115.36,69.9 117.14,68.12 117.14,56.69 115.36,54.91 115.36,47.8 109.78,42.21 109.78,37.13 106.98,34.34 104.44,34.34 100.63,30.53 v100.63,29.77
IC2_4  (via drill 0.5)
  Top 0.5: v48.05,115.36 42.72,115.36 42.21,115.87 40.84,115.87 40.52,115.55 40.37,115.55 40.24,115.42 40.11,115.42 39.9,115.3 39.7,115.35 39.28,115.23 35.81,111.76 34.63,111.76 29.94,107.07 29.37,107.07 28.66,106.36 28.66,106.13 24.49,101.96 24.49,101.6 20.99,98.1 20.88,97.71 20.88,96.11 20.54,95.77 20.12,95.05 19.35,94.28 19.35,92 20.88,90.47 v20.88,89.2 | v31.29,34.59 46.28,19.61 62.4,19.61 PD13.K
  Bottom 0.5: IC2.1 62.73,111.87 R29.2 60.9,112.68 58.21,115.36 v48.05,115.36 | v31.29,34.59 27.99,37.89 27.99,41.2 20.66,48.52 20.66,54.74 19.39,56.01 19.39,77.81 20.88,79.3 v20.88,89.2
IC2_5  (via drill 0.5)
  Top 0.5: PD14.K 55.82,17.83 v59.23,17.83 | v29.77,86.41 33.32,89.96 33.32,91.82 35.02,93.52 v38.4,93.52 | v43.48,93.52 43.99,93.01 43.99,92.76 45.01,91.74 47.55,91.74 49.32,93.52 49.32,95.55 51.36,97.58 51.61,97.58 51.61,99.62 v55.17,99.62
  Bottom 0.5: IC2.5 63.51,100.85 R31.2 60.9,100.02 60.75,99.87 60.5,99.87 59.99,99.36 59.99,98.35 59.48,97.84 57.45,97.84 55.67,99.62 v55.17,99.62 | v59.23,17.83 56.44,20.62 47.8,20.62 30.27,38.15 30.27,40.69 21.89,49.07 21.89,61.01 20.19,62.71 20.19,77.34 23.16,80.31 23.16,84.12 24.18,85.14 28.5,85.14 v29.77,86.41 | v38.4,93.52 40.69,93.52 41.2,93.01 42.97,93.01 v43.48,93.52
IC2_6  (via drill 0.5)
  Top 0.5: PD15.K 40.94,21.39 40.94,22.15 35.35,27.73 30.27,27.73 24.49,33.52 24.49,34.14 21.38,37.24 21.38,39.12 20.54,39.96 20.04,40.83 20.04,41.53 17.19,44.37 17.19,46.33 16.81,47.26 15.54,48.52 15.54,52.55 14.93,53.16 14.67,54.13 14.67,57.59 17.57,60.5 17.57,77.01 v26.97,86.41 | v25.7,89.96 25.7,91.3 27.17,92.77 27.17,95.49 31.54,99.87 31.54,102.41 36.12,102.41 38.91,99.62 v40.18,99.62 | v48.31,104.19 51.36,107.24 v58.72,107.24
  Bottom 0.5: IC2.2 63.44,108.61 R33.2 60.9,107.89 60.25,107.24 v58.72,107.24 | v26.97,86.41 26.97,88.69 v25.7,89.96 | v40.18,99.62 41.77,99.62 42.73,100.57 43.73,100.57 44.69,99.62 48.05,99.62 48.05,103.93 v48.31,104.19
IC2_7  (via drill 0.45)
  Top 0.5: PD16.K 29.87,33.72 v28.24,35.35 | v29.77,94.79 33.07,94.79 34.08,95.81 42.53,95.81 42.73,95.61 43.42,95.61 44.5,94.54 48.31,94.54 48.31,96.31 50.59,98.6 50.59,100.89 51.86,102.16 v55.17,102.16
  Bottom 0.5: IC2.4 63.48,103.36 R35.2 60.9,103.22 59.84,102.16 v55.17,102.16 | v28.24,35.35 26.72,36.88 26.72,41.2 19.86,48.05 19.86,54.4 18.59,55.67 18.59,79.04 19.86,80.31 19.86,89.71 24.94,94.79 v29.77,94.79
IC2_COM  (via drill 0.35)
  Top 0.5: v76.96,93.21 77.21,92.96 77.21,90.09 81.82,90.09 83.91,92.17 83.91,92.72 85.1,92.72 85.1,92.43 86.42,91.1 91.1,91.1 92.67,92.67 99.87,92.67 100.41,93.21 100.41,95.78 J1.5
  Bottom 0.5: IC2.3 63.87,105.87 66.27,105.87 67.36,104.77 67.36,97.07 72.69,97.07 73.2,96.56 73.2,94.03 73.29,93.94 75.98,93.94 76.83,93.09 v76.96,93.21
IC3_0  (via drill 0.35, 0.5)
  Top 0.5: R37.2 53.71,103.36 IC3.13 | PD17.K 21.4,41.07 27.36,41.07 47.76,20.67 87.47,20.67 115.07,48.27 115.07,67.47 116.74,69.14 v116.74,69.9 | v117.32,79.21 115.07,81.47 115.07,82.67 108.14,89.6 108.07,89.6 107.92,89.75 106.55,89.75 106.08,90.22 v105.2,90.22 | v60.27,92.67 62.7,90.23 75.98,90.23 v75.99,90.22
  Bottom 0.5: v116.74,69.9 117.32,70.49 v117.32,79.21 | v60.27,92.67 59.47,92.67 55.07,97.07 51.87,97.07 50.96,97.97 50.96,100.96 53.47,103.47 IC3.13 | v75.99,90.22 76.35,90.22 76.57,90 78.32,90 78.53,90.22 v105.2,90.22
IC3_1  (via drill 0.35)
  Top 0.5: R39.2 53.78,106.1 IC3.14 | PD18.K 16.17,53.96 48.67,21.47 87.07,21.47 114.27,48.67 114.27,67.8 115.11,68.65 115.11,71.17 114.01,72.27 114.01,82.52 107.58,88.95 106.22,88.95 105.97,89.2 57.2,89.2 54.91,91.49 52.88,91.49 51.47,92.9 v51.47,93.07
  Bottom 0.5: v51.47,93.07 51.07,93.07 50.16,93.97 50.16,102.48 IC3.14
IC3_2  (via drill 0.45, 0.5)
  Top 0.5: R41.2 53.75,108.61 IC3.15 | PD19.K 14.14,73.55 13.33,74.36 13.33,75.4 14.14,76.21 14.14,81.19 14.71,81.77 14.82,82.15 14.82,84.85 14.88,86.26 16.92,88.29 16.92,88.43 17.3,89.35 17.68,89.74 17.86,89.74 v18.84,90.73 | v49.07,101.14 49.07,98.85 47.29,97.08 44.75,97.08 43.8,98.03 36.94,98.03 33.83,101.14 v33.07,101.14 | v21.38,92.76 27.99,99.36 27.99,100.38 v29.77,100.38
  Bottom 0.5: v18.84,90.73 20.88,92.76 v21.38,92.76 | v29.77,100.38 30.53,101.14 v33.07,101.14 | v49.07,101.14 49.07,102.92 51.36,105.2 51.36,106.22 IC3.15
IC3_3  (via drill 0.35)
  Top 0.5: IC3.12 53.68,100.85 R43.2 56.44,100.72 56.44,98.44 55.07,97.07 52.53,97.07 50.54,95.07 50.54,92.96 49.66,92.08 51.47,90.27 54.27,90.27 55.87,88.67 55.87,85.07 53.07,82.27 49.47,82.27 v48.67,83.07 | v39.07,86.67 39.07,90.23 39.87,91.03 39.87,94.77 34.77,94.77 31.07,91.07 29.47,91.07 20.27,81.87 16.27,81.87 PD20.K
  Bottom 0.5: v39.07,86.67 39.47,86.27 39.47,82.67 39.87,82.27 47.87,82.27 v48.67,83.07
IC3_4  (via drill 0.45)
  Top 0.5: v41.45,110.54 37.89,110.54 33.28,105.93 31.9,105.93 30.42,104.44 30.02,104.44 26.51,100.93 26.51,100.05 21.34,94.88 PD21.K
  Bottom 0.5: IC3.1 45.53,110.56 R45.2 41.47,110.56 v41.45,110.54
IC3_5  (via drill 0.45)
  Top 0.5: v32.31,104.95 39.16,104.95 42.47,101.65 44.11,101.65 44.4,101.36 45.55,101.36 IC3.5
  Bottom 0.5: R47.2 45.26,101.65 IC3.5 | PD22.K 31.14,105.86 32.05,104.95 v32.31,104.95
IC3_6
  Top 0.5: IC3.2 45.75,108.78 R49.2 42.72,112.68 PD23.K
IC3_7
  Top 0.5: PD24.K 53.96,113.9 50.59,110.54 50.59,108 47.35,104.76 46.08,104.76 46.02,104.7 IC3.4
  Bottom 0.5: R51.2 46,103.41 IC3.4
IC3_COM  (via drill 0.35, 0.45, 0.5)
  Top 0.5: IC3.3 v49.32,109.27 | v75.23,99.62 68.37,99.62 65.83,102.16 65.83,109.01 65.01,109.84 62.39,109.84 62.19,110.03 v61.77,110.03 | v91.74,93.52 90.22,92 86.66,92 85.9,92.76 85.9,93.52 83.11,93.52 83.11,92.76 82.34,92 79.97,92 79.2,92.77 79.2,93.61 78.03,94.79 v78.03,95.3 | v55.17,109.78 55.67,110.28 v57.96,110.28 | J1.6 101.65,95.96 v101.65,94.54
  Bottom 0.5: v49.32,109.27 51.36,109.27 51.86,109.78 v55.17,109.78 | v75.23,99.62 78.28,96.57 78.28,95.55 v78.03,95.3 | v91.74,93.52 100.63,93.52 v101.65,94.54 | v57.96,110.28 61.52,110.28 v61.77,110.03
N$1
  Bottom 1.27: R2.1 R1.2
N$4
  Top 0.5: R8.2 R7.1
N$6
  Top 0.5: R9.1 R10.2
N$8
  Top 0.5: R12.2 R11.1
N$10
  Top 0.5: R13.1 R14.2
N$12
  Bottom 0.5: R15.1 R16.2
N$14
  Bottom 0.5: R17.1 R18.2
N$16
  Bottom 0.5: R20.2 R19.1
N$18
  Top 0.5: R22.2 R21.1
N$20
  Top 0.5: R24.2 R23.1
N$22
  Top 0.5: R26.2 R25.1
N$24
  Top 0.5: R27.1 R28.2
N$26
  Bottom 0.5: R29.1 R30.2
N$27
  Top 0.5: R6.2 R5.1
N$28
  Bottom 1.27: R4.1 R53.2
N$30
  Bottom 1.27: R4.2 R3.1
N$31
  Bottom 0.5: R31.1 R32.2
N$33
  Bottom 0.5: R33.1 R34.2
N$35
  Bottom 0.5: R36.2 R35.1
N$37
  Top 0.5: R37.1 R38.2
N$39
  Top 0.5: R40.2 R39.1
N$41
  Top 0.5: R41.1 R42.2
N$43
  Top 0.5: R43.1 R44.2
N$45
  Bottom 0.5: R45.1 R46.2
N$47
  Bottom 0.5: R47.1 R48.2
N$49
  Top 0.5: R49.1 R50.2
N$51
  Bottom 0.5: R51.1 R52.2